# EAGLE schematic lm358-thermostat (EAGLE 5.07)
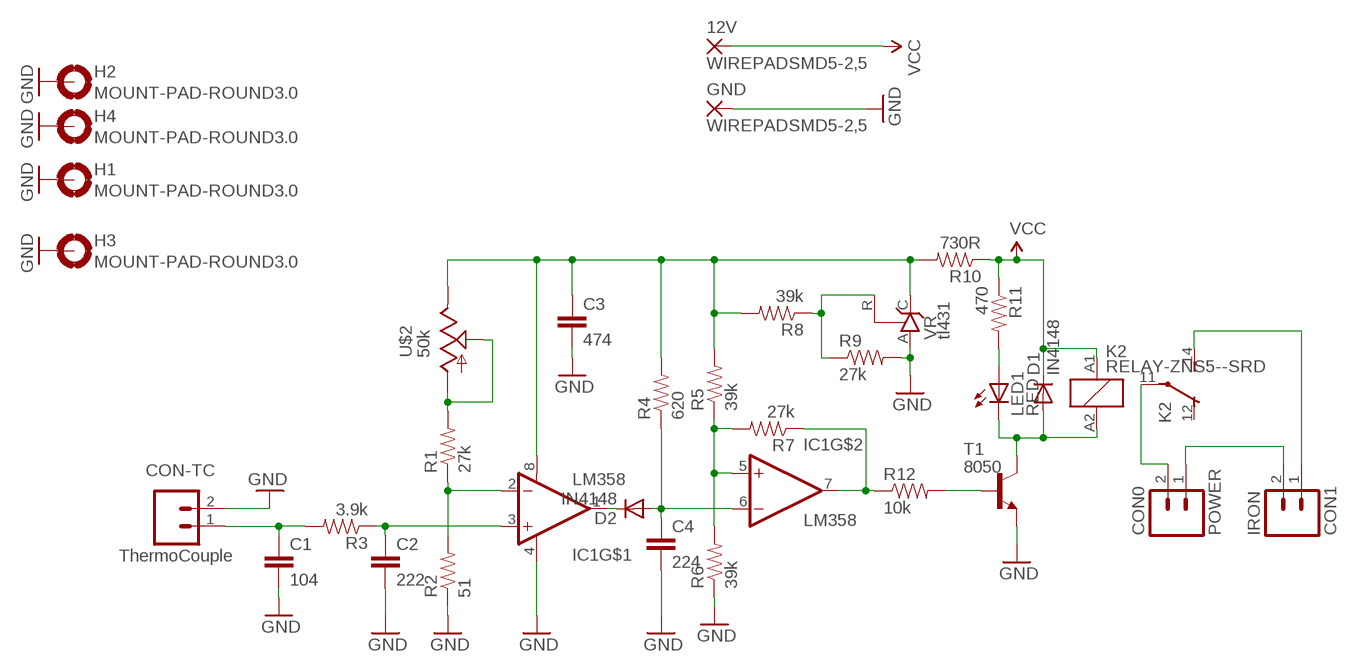
[diagram p0: schematic, sheet 1]

## Parts
12V  WIREPADSMD5-2,5  [5-2,5]
C1  104  CAPPTH  [CAP-PTH-SMALL]
C2  222  CAP0805  [0805]
C3  474  CAP0805  [0805]
C4  224  CAP0805  [0805]
CON0  POWER  M025MM  [SCREWTERMINAL-5MM-2]
CON-TC  ThermoCouple  M025MM  [SCREWTERMINAL-5MM-2]
D1  IN4148  DIODE1N4148  [DIODE-1N4148]
D2  IN4148  DIODE1N4148  [DIODE-1N4148]
GND  WIREPADSMD5-2,5  [5-2,5]
H1  MOUNT-PAD-ROUND3.0  [3,0-PAD]
H2  MOUNT-PAD-ROUND3.0  [3,0-PAD]
H3  MOUNT-PAD-ROUND3.0  [3,0-PAD]
H4  MOUNT-PAD-ROUND3.0  [3,0-PAD]
IC1  LM358  [DIP08]
IRON  CON1  M025MM  [SCREWTERMINAL-5MM-2]
K2  RELAY-ZNS5--SRD  [SRD-05]
LED1  RED  LED5MM  [LED5MM]
R1  27k  RESISTOR1/4W  [AXIAL-0.3]
R2  51  RESISTOR1/4W  [AXIAL-0.3]
R3  3.9k  RESISTOR1/4W  [AXIAL-0.3]
R4  620  RESISTOR1/4W  [AXIAL-0.3]
R5  39k  RESISTOR1/4W  [AXIAL-0.3]
R6  39k  RESISTOR1/4W  [AXIAL-0.3]
R7  27k  RESISTOR1/4W  [AXIAL-0.3]
R8  39k  RESISTOR1/4W  [AXIAL-0.3]
R9  27k  RESISTOR1/4W  [AXIAL-0.3]
R10  730R  RESISTOR1/4W  [AXIAL-0.3]
R11  470  RESISTOR1/4W  [AXIAL-0.3]
R12  10k  RESISTOR1/4W  [AXIAL-0.3]
T1  8050  90**-NPN-TO92-EBC  [TO92-EBC]
U$2  50k  POTB64Y-3296  [B64Y]
VR  tl431  TL431RAC  [TO92-RAC]

## Nets
GND: C1.2 C2.2 C3.2 C4.2 CON-TC.2 GND.1(P) H1.B3,0(MOUNT) H2.B3,0(MOUNT) H3.B3,0(MOUNT) H4.B3,0(MOUNT) IC1.4(V-) R2.P$1 R6.P$1 R9.P$2 T1.E VR.A
N$1: C2.1 IC1.3(+IN) R3.P$1
N$2: IC1.2(-IN) R1.P$1 R2.P$2
N$3: R1.P$2 U$2.A U$2.S
N$4: IC1.7(OUT) R7.P$1 R12.P$1
N$5: C1.1 CON-TC.1 R3.P$2
N$6: D2.C IC1.1(OUT)
N$7: C4.1 D2.A IC1.6(-IN) R4.P$1
N$8: R12.P$2 T1.B
N$9: D1.A K2.A2 LED1.K(C) T1.C
N$10: C3.1 IC1.8(V+) R4.P$2 R5.P$2 R8.P$2 R10.P$2 U$2.E VR.C
N$11: IC1.5(+IN) R5.P$1 R6.P$2 R7.P$2
N$12: R8.P$1 R9.P$1 VR.R
N$14: CON0.1 IRON.2
N$15: CON0.2 K2.11(2:P)
N$16: IRON.1 K2.14(2:S)
N$17: LED1.A R11.P$2
VCC: 12V.1(P) D1.C K2.A1 R10.P$1 R11.P$1
Unconnected: K2.12(2:O)

## Library data of the parts
12V GND = wirepad:WIREPAD: Wire PAD connect wire on PCB
C1-C4 = digital-toy:CAP: Capacitor Standard 0603 ceramic capacitor, and 0.1" leaded capacitor.
CON0 CON-TC IRON = SparkFun:M02: Header 2 Standard 2-pin 0.1" header. Use with straight break away headers (SKU : PRT-00116), right angle break away headers (PRT-00553), swiss pins (PRT-00743), machine pins (PRT-00117), and female headers (PRT-00115). Molex polarized connector foot print use with SKU : PRT-08233 with associated crimp pins and housings.
D1 D2 = digital-toy:DIODE: Diode These are standard reverse protection diodes and small signal diodes. SMA package can handle up to about 1A. SOD-323 can handle about 200mA. What the SOD-323 package when ordering, there are some mfgs out there that are 5-pin packages.
H1-H4 = holes:MOUNT-PAD-ROUND: MOUNTING PAD, round
IC1 = digital-toy:LM358
K2 = digital-toy:RELAY-ZNS5-*: Miniature Power PCB Relay SCHRACK 1pole 10 A Source: http://www.schrack.com/.. 5847.pdf
LED1 = SparkFun:LED: LEDs Standard schematic elements and footprints for 5mm, 3mm, 1206, and 0603 sized LEDs. 5mm - Spark Fun Electronics SKU : COM-00529 (and others)
R1-R12 = digital-toy:RESISTOR: Resistor Basic schematic elements and footprints for 0603, 1206, and PTH 1/10th watt (small) resistors. digital-toy copy vertical mount of axial-0.3 from rcl.lbr : the 0207/xx
T1 = digital-toy:*-NPN-: NPN Transistror most of sot-23 use the pacages sot23-BEC, top C, left B, right E. by hyl, digital-toy. and to-92 use ebc(from-top) by hyl, digital-toy.
U$2 = digital-toy:POT: POT digital toy POT, 3296 multi turn, blue-white ... hyl 8/07/2001
VR = digital-toy:TL431: VOLTAGE REGULATOR